# EAGLE design duende (EAGLE 7.6.0)
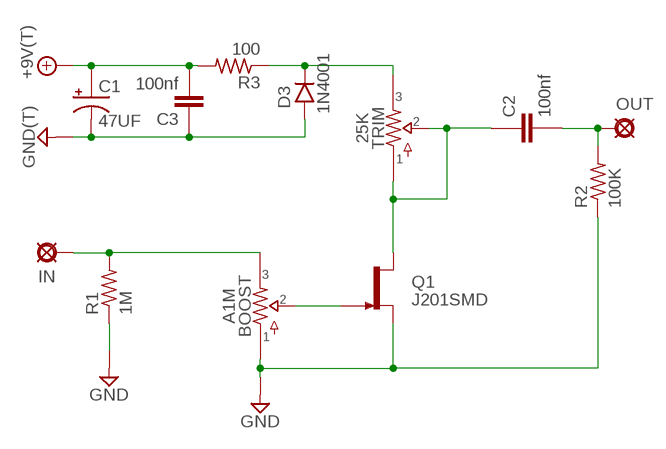
[diagram p0: schematic, sheet 1]

## Parts
+9V  +9V(T)  [SQUARE]
BOOST  A1M  POTSSMALL_PADS  [PADS_SMALL]
C1  47UF  0501  [050_020_1]
C2  100nf  072X0252  [072X025]
C3  100nf  072X0252  [072X025]
D3  1N4001  1N400X.2  [DO41-2]
GND  GND(T)  [SQUARE]
IN  IN]  PADO  [ROUND]
OUT  OUT  PADO  [ROUND]
Q1  J201SMD  [SOT23]
R1  1M  3MM.2  [R0204/2]
R2  100K  3MM.2  [R0204/2]
R3  100  3MM.2  [R0204/2]
TRIM  25K  POTSTRIM  [TRIM-ALL]

## Nets
+9V: +9V.1(+9V) C1.+ C3.2 R3.2
FXOUT: C2.2 OUT.1(PAD) R2.2
GND: BOOST.1 C1.- C3.1 D3.A GND.1(GND) Q1.E(S) R1.1 R2.1
N$1: BOOST.3 IN.1(PAD) R1.2
N$2: D3.C R3.1 TRIM.3 TRIM.6
N$6: BOOST.2 Q1.C(G)
N$7: C2.1 Q1.B(D) TRIM.1 TRIM.2 TRIM.4 TRIM.5

## Library data of the parts
+9V = kdd-supply:+9V(T): +9V Voltage Supply use this to hook up +9v throughout a schematic instead of running wire automatically labels the net "+9v" adds a hookup pad to the circuit board
BOOST TRIM = kdd-mb-pots:POTS
C1 = kdd-caps-electro-pol:050: 0.22 - 100uF Xicon values at Mouser.com: 10V: 10 - 100uF; 16V: 2.2 - 47uF; 25V: 0.47 - 47uF; 50V: 0.22 - 22uF
C2 C3 = kdd-caps-film-box:072X025: 1000pF - 0.47uF WIMA MKP2 63, 100V: 1000pF - 0.015uF; MKS2 50V: 0.33 - 0.47uF; 63V: 1000pF - 0.22uF;
D3 = kdd-diodes:1N400X: Rectifier Diodes often used in power supply to prevent damage from reverse polarization
GND = kdd-supply:GND(T): Ground use this to hook up ground (GND) throughout a schematic instead of running wire automatically labels the net "GND" adds a hookup pad to the circuit board (you can use several)
IN OUT = kdd-supply:PAD: PAD use this package for pads with any purpose, including input, output, send or return various pad shapes: round, square, octogonal, long, and long offset
Q1 = kdd-trans:J201: N-channel JFET
R1-R3 = kdd-resistors:3MM: 3mm Resistors Leads spaced 1-6 holes apart for 0.1" perfboard. Suitable for 1/8 watt resistors.

## Net classes
0 default: width 0.508 mm, clearance 0.508 mm

## Board
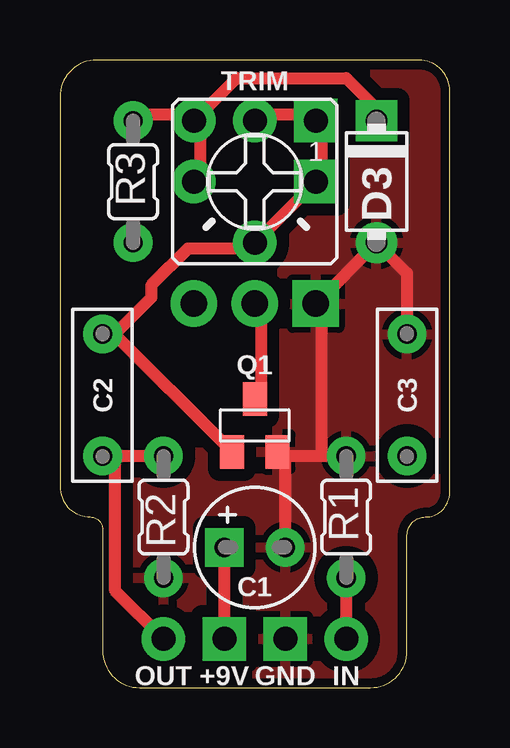
[diagram p1: board, top side]
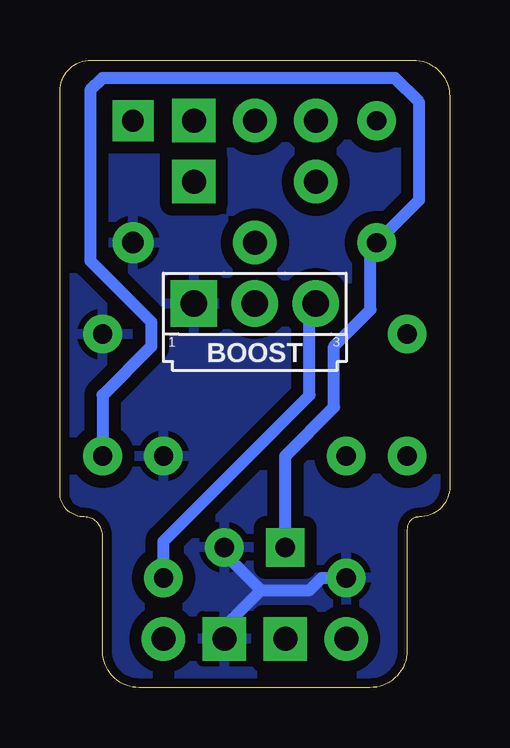
[diagram p2: board, bottom side, seen from below]

Size 16.26 x 26.15 mm. Coordinates in mm from the lower left corner, seen from the top.
Outline: 1.78,6.6 1.78,1.55 arc90 3.32,0 12.95,0 arc90 14.48,1.52 14.48,6.35 arc-90 15.24,7.11 arc90 16.26,8.13 16.26,24.87 arc90 14.97,26.15 1.54,26.15 arc90 0,24.62 0,8.38 arc90 1.27,7.11 arc-90 1.78,6.6
Copper layers (1*16): Top 0.0356mm / dielectric 1.5011mm / Bottom 0.0356mm
Design rules "Kyle-OSH": minimum track width 6mil, minimum drill 13mil, track to track 8mil, track to pad 8mil, pad to pad 8mil, via to via 8mil, smd to smd 6mil, copper to edge 15mil, drill to drill 6mil, minimum pad ring 16mil, minimum via ring 7mil, stop-mask expansion 3mil, vias tented up to drill 25mil, thermal gap 10mil

### Footprints (pad centres in the part's own frame; a part is rotated, then mirrored left to right if it is on the bottom)
SQUARE = drill 1 square: 1 0,0
PADS_SMALL = drill 1.1 pad 1.93 square: 1 2.54,0 | drill 1.1 pad 1.93: 2 0,0; 3 -2.54,0
050_020_1 = drill 0.8 square: + -1.27,0 | drill 0.8: - 1.27,0
072X025 = drill 0.8: 1 -2.54,0; 2 2.54,0
DO41-2 = drill 0.9: A 2.54,0 | drill 0.9 square: C -2.54,0
ROUND = drill 1: 1 0,0
SOT23 = smd 1 x 1.4: B -0.95,-1.1; C 0,1.1; E 0.95,-1.1
R0204/2 = drill 0.8: 1 -2.54,0; 2 2.54,0
TRIM-ALL = drill 1 square: 1 -2.54,0; 4 -2.54,-2.54 | drill 1: 2 0,2.54; 3 2.54,0; 5 0,-2.54; 6 2.54,-2.54

### Placement (x,y rotation side)
+9V  6.86,2.03 0 top
BOOST  8.13,16 180 bottom
C1  8.13,5.84 0 top
C2  1.78,12.19 270 top
C3  14.48,12.19 270 top
D3  13.21,21.08 270 top
GND  9.4,2.03 0 top
IN  11.94,2.03 0 top
OUT  4.32,2.03 0 top
Q1  8.13,10.92 0 top
R1  11.94,7.11 270 top
R2  4.32,7.11 90 top
R3  3.05,21.08 270 top
TRIM  8.13,21.08 180 top

### Tracks (layer width: path | path; a pad name or v marks a point on that pad's centre or on a via)
+9V
  Top 0.508: +9V.1 C1.+
  Bottom 0.508: C1.+ 6.86,9.65 4.83,11.68 4.83,14.22 3.3,15.75 3.3,18.29 R3.2 1.27,20.32 1.27,24.38 2.29,25.4 14.48,25.4 14.99,24.89 14.99,17.78 12.45,15.24 12.45,14.22 14.48,12.19 C3.2
FXOUT
  Top 0.508: R2.2 2.29,9.65 | OUT.1 2.29,4.06 2.29,9.65 | 2.29,9.65 C2.2
GND
  Top 0.508: C3.1 14.48,17.27 D3.A BOOST.1 10.92,15.75 10.92,9.65 | R1.1 10.92,9.65 | 10.92,9.65 9.4,9.65 | C1.- 9.4,9.65 | 9.4,9.65 Q1.E
  Bottom 0.508: R2.1 5.33,4.57 5.84,4.06 7.87,4.06 | 7.87,4.06 9.4,5.59 C1.- | GND.1 9.4,2.54 7.87,4.06
  pour Bottom: -3.3,28.7 19.56,28.7 19.56,-3.05 -3.3,-3.05
  pour Top: -2.03,27.43 -2.03,-1.78 18.29,-1.78 18.29,27.43
N$1
  Top 0.508: IN.1 R1.2
  Bottom 0.508: R1.2 11.94,6.1 5.84,12.19 5.84,15.75 BOOST.3
N$2
  Top 0.508: R3.1 3.3,23.88 5.33,23.88 TRIM.6 | TRIM.6 7.37,25.4 11.94,25.4 12.95,24.38 12.95,23.88 D3.C | TRIM.3 5.84,21.34 5.84,23.37 TRIM.6
N$6
  Top 0.508: Q1.C 8.38,12.19 8.38,15.75 BOOST.2
N$7
  Top 0.508: 2.29,14.73 6.86,10.16 Q1.B | TRIM.5 8.38,23.88 10.41,23.88 TRIM.4 10.92,23.37 10.92,21.34 TRIM.1 TRIM.2 7.87,18.29 5.33,18.29 3.81,16.76 3.81,16.26 2.29,14.73 | 2.29,14.73 C2.1